# EAGLE design STM32BoardBeta2 (EAGLE 7.2.0)
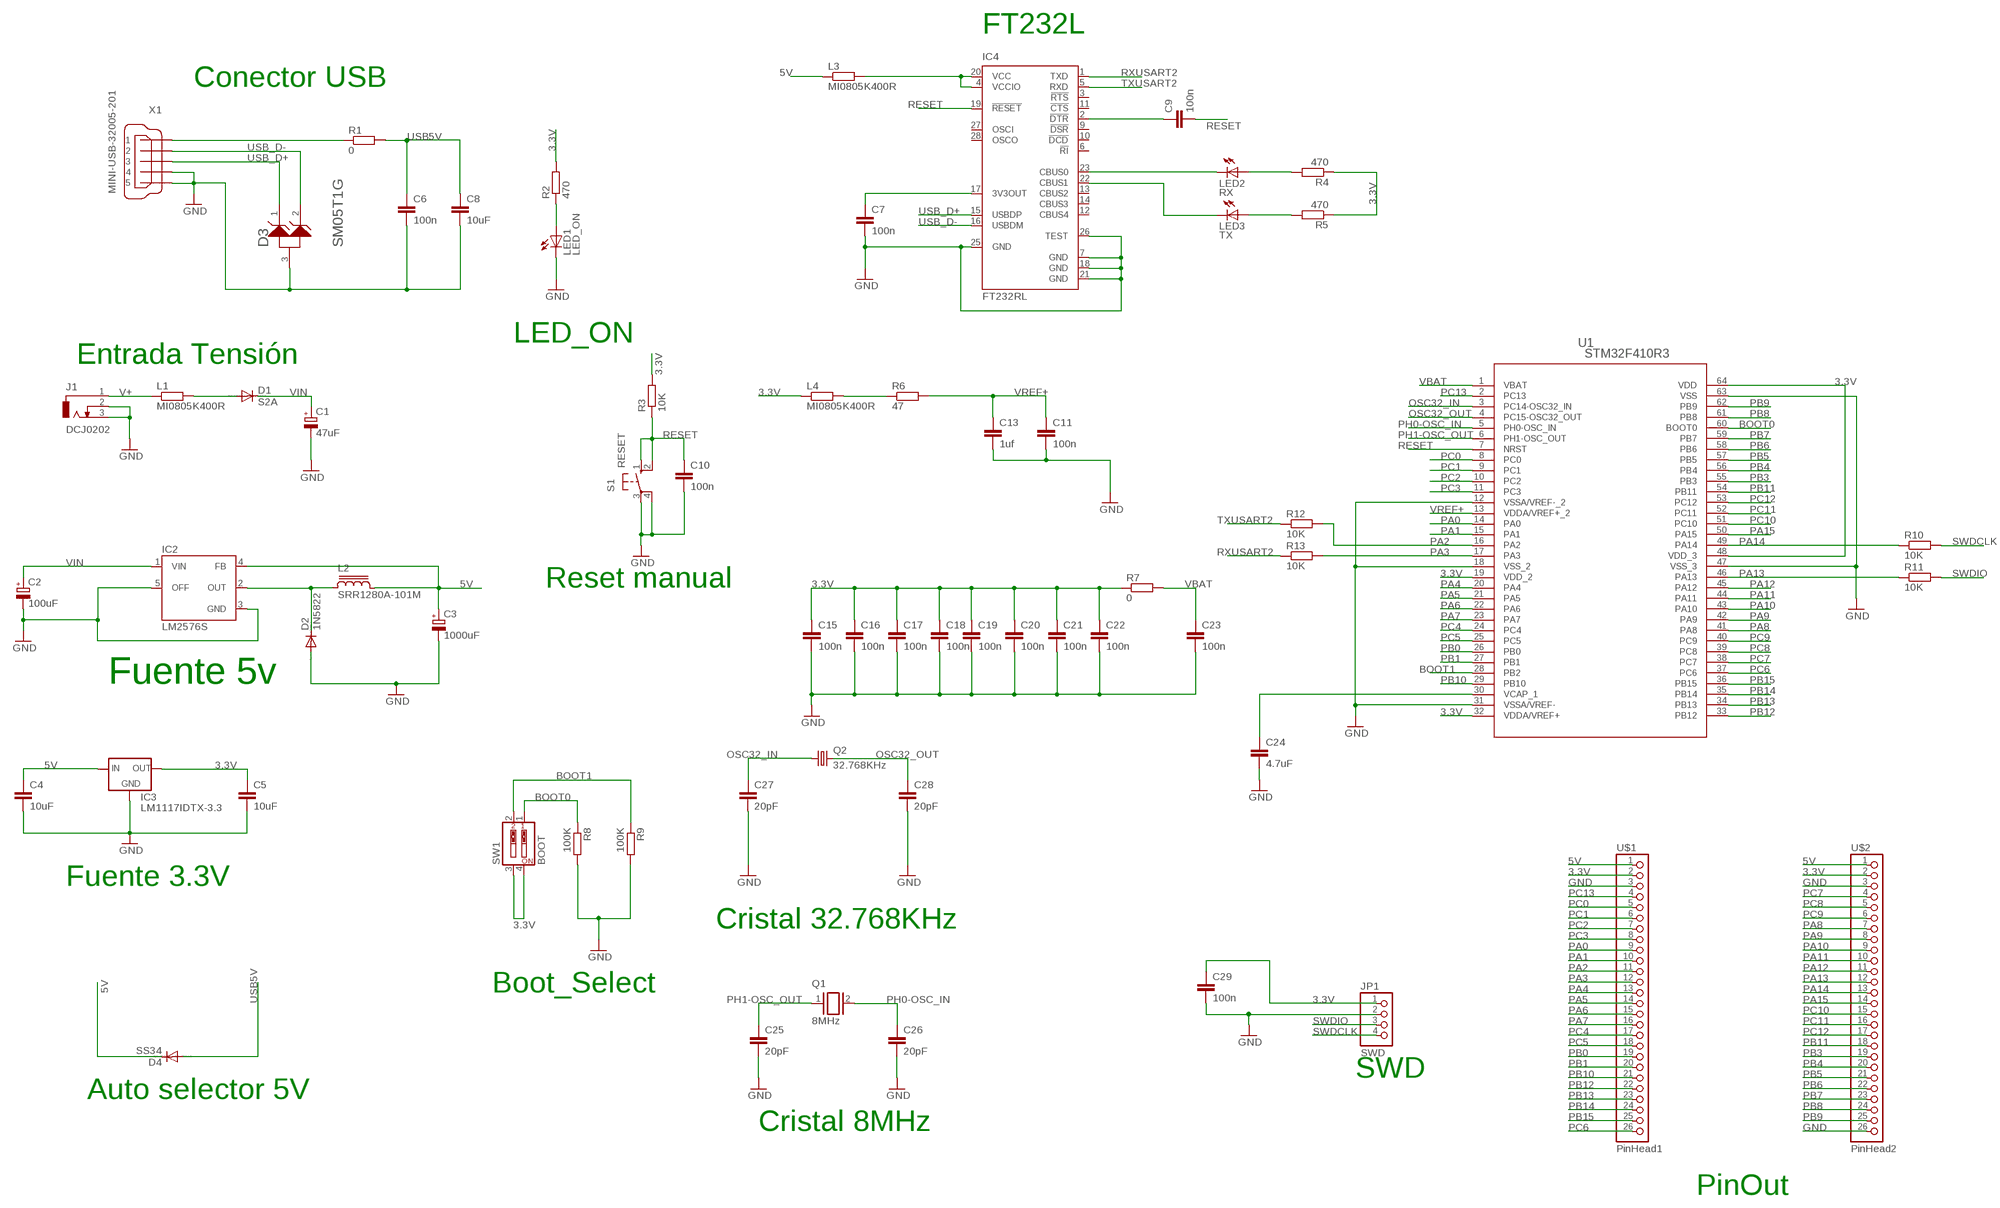
[diagram p0: schematic, sheet 1]

## Parts
C1  47uF  CPOL-EU153CLV-0605  [153CLV-0605]
C2  100uF  CPOL-EU153CLV-0605  [153CLV-0605]
C3  1000uF  CPOL-EUE7.5-18  [E7,5-18]
C4  10uF  C-EUC1206K  [C1206K]
C5  10uF  C-EUC1206K  [C1206K]
C6  100n  C-EUC0805K  [C0805K]
C7  100n  C-EUC0805K  [C0805K]
C8  10uF  C-EUC1206K  [C1206K]
C9  100n  C-EUC0805K  [C0805K]
C10  100n  C-EUC0805K  [C0805K]
C11  100n  C-EUC0201  [C0201]
C13  1uf  C-EUC0603  [C0603]
C15  100n  C-EUC0805K  [C0805K]
C16  100n  C-EUC0805K  [C0805K]
C17  100n  C-EUC0805K  [C0805K]
C18  100n  C-EUC0805K  [C0805K]
C19  100n  C-EUC0805K  [C0805K]
C20  100n  C-EUC0805K  [C0805K]
C21  100n  C-EUC0805K  [C0805K]
C22  100n  C-EUC0805K  [C0805K]
C23  100n  C-EUC0805K  [C0805K]
C24  4.7uF  C-EUC1206K  [C1206K]
C25  20pF  C-EUC0805K  [C0805K]
C26  20pF  C-EUC0805K  [C0805K]
C27  20pF  C-EUC0805K  [C0805K]
C28  20pF  C-EUC0805K  [C0805K]
C29  100n  C-EUC0201  [C0201]
D1  S2A  DIODE-DO214AA  [DO214AA]
D2  1N5822  1N4004  [DO41-10]
D3  ON_SEMICONDUCTOR_SM05T1GON_SEMICONDUCTOR_SM05T1G_0_0  [ON_SEMICONDUCTOR_SM05T1G_0]
D4  SS34  DIODE-DO-214AC  [DO-214AC]
IC2  LM2576S  [TO263-5]
IC3  LM1117IDTX-3.3  [TO252]
IC4  FT232RL  [SSOP28]
J1  DCJ0202  [DCJ0202]
JP1  SWD  PINHD-1X4_2.54  [1X04]
L1  MI0805K400R  R-EU_M0805  [M0805]
L2  SRR1280A-101M  SRR1280  [SRR1280]
L3  MI0805K400R  R-EU_M0805  [M0805]
L4  MI0805K400R  R-EU_M0805  [M0805]
LED1  LED_ON  LEDCHIP-LED0805  [CHIP-LED0805]
LED2  RX  LEDCHIP-LED0805  [CHIP-LED0805]
LED3  TX  LEDCHIP-LED0805  [CHIP-LED0805]
Q1  8MHz  XTAL/S  [QS]
Q2  32.768KHz  CRYSTALTC26V  [TC26V]
R1  0  R-EU_M1206  [M1206]
R2  470  R-EU_R0805  [R0805]
R3  10K  R-EU_R1206  [R1206]
R4  470  R-EU_R0805  [R0805]
R5  470  R-EU_R0805  [R0805]
R6  47  R-EU_R0402  [R0402]
R7  0  R-EU_M1206  [M1206]
R8  100K  R-EU_R0805  [R0805]
R9  100K  R-EU_R0805  [R0805]
R10  10K  R-EU_R0805  [R0805]
R11  10K  R-EU_R0805  [R0805]
R12  10K  R-EU_R0805  [R0805]
R13  10K  R-EU_R0805  [R0805]
S1  RESET  10-XX  [B3F-10XX]
SW1  BOOT  SW_DIP-2  [EDG-02]
U1  STM32F410R3  [LQFP64-10X10MM]
U$1  PinHead1  PINHD-1X26_2.54  [1X26]
U$2  PinHead2  PINHD-1X26_2.54  [1X26]
X1  MINI-USB-32005-201  [32005-201]

## Nets
3.3V: C5.1 C15.1 C16.1 C17.1 C18.1 C19.1 C20.1 C21.1 C22.1 C29.1 IC3.TAB(OUT) JP1.1 L4.1 R2.2 R3.2 R4.1 R5.1 R7.1 SW1.3 SW1.4 U1.19(VDD_2) U1.32(VDDA/VREF+) U1.48(VDD_3) U1.64(VDD) U$1.2 U$2.2
5V: C3.+ C4.1 D4.C IC2.4(FB) IC3.2(IN) L2.2 L3.1 U$1.1 U$2.1
BOOT0: R8.1 SW1.1 U1.60(BOOT0)
BOOT1: R9.1 SW1.2 U1.28(PB2)
GND: C1.- C2.- C3.- C4.2 C5.2 C6.2 C7.2 C8.2 C10.2 C11.2 C13.2 C15.2 C16.2 C17.2 C18.2 C19.2 C20.2 C21.2 C22.2 C23.2 C24.2 C25.2 C26.2 C27.2 C28.2 C29.2 D2.A D3.3(A) IC2.3(GND) IC2.5(OFF) IC3.1(GND) IC4.7(GND) IC4.18(GND) IC4.21(GND) IC4.25(GND) IC4.26(TEST) J1.2 J1.3 JP1.2 LED1.C R8.2 R9.2 S1.3(P) S1.4(P1) U1.12(VSSA/VREF-_2) U1.18(VSS_2) U1.31(VSSA/VREF-) U1.47(VSS_3) U1.63(VSS) U$1.3 U$2.3 U$2.26 X1.4 X1.5
N$1: LED1.A R2.1
N$2: IC4.4(VCCIO) IC4.20(VCC) L3.2
N$3: D1.A L1.2
N$4: D2.C IC2.2(OUT) L2.1
N$5: C7.1 IC4.17(3V3OUT)
N$6: R1.1 X1.1
N$7: IC4.23(CBUS0) LED2.C
N$8: C9.1 IC4.2(!DTR)
N$9: IC4.22(CBUS1) LED3.C
N$10: LED2.A R4.2
N$11: LED3.A R5.2
N$12: C24.1 U1.30(VCAP_1)
OSC32_IN: C27.1 Q2.1 U1.3(PC14-OSC32_IN)
OSC32_OUT: C28.1 Q2.2 U1.4(PC15-OSC32_OUT)
PA0: U1.14(PA0) U$1.9
PA1: U1.15(PA1) U$1.10
PA2: R12.2 U1.16(PA2) U$1.11
PA3: R13.2 U1.17(PA3) U$1.12
PA4: U1.20(PA4) U$1.13
PA5: U1.21(PA5) U$1.14
PA6: U1.22(PA6) U$1.15
PA7: U1.23(PA7) U$1.16
PA8: U1.41(PA8) U$2.7
PA9: U1.42(PA9) U$2.8
PA10: U1.43(PA10) U$2.9
PA11: U1.44(PA11) U$2.10
PA12: U1.45(PA12) U$2.11
PA13: R11.1 U1.46(PA13) U$2.12
PA14: R10.1 U1.49(PA14) U$2.13
PA15: U1.50(PA15) U$2.14
PB0: U1.26(PB0) U$1.19
PB1: U1.27(PB1) U$1.20
PB3: U1.55(PB3) U$2.19
PB4: U1.56(PB4) U$2.20
PB5: U1.57(PB5) U$2.21
PB6: U1.58(PB6) U$2.22
PB7: U1.59(PB7) U$2.23
PB8: U1.61(PB8) U$2.24
PB9: U1.62(PB9) U$2.25
PB10: U1.29(PB10) U$1.21
PB11: U1.54(PB11) U$2.18
PB12: U1.33(PB12) U$1.22
PB13: U1.34(PB13) U$1.23
PB14: U1.35(PB14) U$1.24
PB15: U1.36(PB15) U$1.25
PC0: U1.8(PC0) U$1.5
PC1: U1.9(PC1) U$1.6
PC2: U1.10(PC2) U$1.7
PC3: U1.11(PC3) U$1.8
PC4: U1.24(PC4) U$1.17
PC5: U1.25(PC5) U$1.18
PC6: U1.37(PC6) U$1.26
PC7: U1.38(PC7) U$2.4
PC8: U1.39(PC8) U$2.5
PC9: U1.40(PC9) U$2.6
PC10: U1.51(PC10) U$2.15
PC11: U1.52(PC11) U$2.16
PC12: U1.53(PC12) U$2.17
PC13: U1.2(PC13) U$1.4
PH0-OSC_IN: C26.1 Q1.2 U1.5(PH0-OSC_IN)
PH1-OSC_OUT: C25.1 Q1.1 U1.6(PH1-OSC_OUT)
RESET: C9.2 C10.1 IC4.19(!RESET) R3.1 S1.1(S) S1.2(S1) U1.7(NRST)
RXUSART2: IC4.1(TXD) R13.1
SWDCLK: JP1.4 R10.2
SWDIO: JP1.3 R11.2
TXUSART2: IC4.5(RXD) R12.1
USB5V: C6.1 C8.1 D4.A R1.2
USB_D+: D3.1(K1) IC4.15(USBDP) X1.3
USB_D-: D3.2(K2) IC4.16(USBDM) X1.2
V+: J1.1 L1.1
VBAT: C23.1 R7.2 U1.1(VBAT)
VIN: C1.+ C2.+ D1.C IC2.1(VIN)
VREF+: C11.1 C13.1 R6.2 U1.13(VDDA/VREF+_2)
VREF+2: L4.2 R6.1
Unconnected: IC4.3(!RTS) IC4.6(!RI) IC4.9(!DSR) IC4.10(!DCD) IC4.11(!CTS) IC4.12(CBUS4) IC4.13(CBUS2) IC4.14(CBUS3) IC4.27(OSCI) IC4.28(OSCO)

## Notes on the sheet
- FT232L
- Conector USB
- LED_ON
- Entrada Tensión
- Reset manual
- Fuente 5v
- Fuente 3.3V
- Cristal 32.768KHz
- Boot_Select
- SWD
- Auto selector 5V
- Cristal 8MHz
- PinOut

## Library data of the parts
C1-C3 = rcl:CPOL-EU: POLARIZED CAPACITOR, European symbol
C4-C11 C13 C15-C29 = rcl:C-EU: CAPACITOR, European symbol
D1 D4 = diode:DIODE-: DIODE
D2 = diode:1N4004: DIODE general purpose rectifier, 1 A
D3 = On Semiconductor - SM05T1G:ON_SEMICONDUCTOR_SM05T1G: ONSC-K1K2A3-3; COMPONENT_LINK_1_DESCRIPTION: Manufacturer URL; COMPONENT_LINK_1_URL: http://www.onsemi.com/; COMPONENT_LINK_3_DESCRIPTION: Package Specification; COMPONENT_LINK_3_URL: http://www.onsemi.cn/pub_link/Collateral/318-08.PDF; DATASHEET: http://www.onsemi.com/pub_link/Collateral/SM12T1-D.PDF; DATASHEET_VERSION: Rev. 6; DIRECTION: Unidirectional; IMPORTED: yes; IMPORTED_FROM: vault; IMPORT_TS: 1521207419; IR_MAX_UA: 10; MF: On Semiconductor; MOUNTING_TECHNOLOGY: Surface Mount; MPN: SM05T1G; PACKAGE: SOT-23-3-318-08; PACKAGE_DESCRIPTION: 3-Pin Small Outline Transistor, Body 2.92 x 1.3 mm, Pitch 0.95 mm; PACKAGE_VERSION: Rev. AP, 11/2009; PACKING: Tape and Reel; PPK_MAX_W: 300; PREFIX: D; ROHS: No; VAULT_GUID: 89044E51-EF64-408A-9843-719D3C75EAAE; VAULT_REVISION: BDB54648-0F6E-4B9B-8D45-1873251A89B8
IC2 = v-reg-3:LM2576: National Semiconductor <http://www.national.com> 3.0A "Simple Switcher"(c) 52kHz, Vout 1.23-37V (HV: 57V), Vin 40V (HV: 60V), 50µA standby current
IC3 = lm1117:LM1117IDTX-*
IC4 = ftdichip:FT232R: Source: http://www.ftdichip.com/Documents/DataSheets/DS_FT232R_v104.pdf; MPN: FT232RL; OC_FARNELL: 1146032; OC_NEWARK: 91K9918
J1 = con-jack:DCJ0202: DC POWER JACK Source: DCJ0202.pdf; OC_FARNELL: unknown; OC_NEWARK: unknown
JP1 = pinhead-1:PINHD-1X4: PIN HEADER
L1 L3 L4 = resistor:R-EU_: RESISTOR, European symbol
L2 = inductor-bourns:SRR1280: POWER INDUCTOR
LED1-LED3 = led:LED: LED OSRAM: - CHIPLED LG R971, LG N971, LY N971, LG Q971, LY Q971, LO R971, LY R971 LH N974, LH R974 LS Q976, LO Q976, LY Q976 LO Q996 - Hyper CHIPLED LW Q18S LB Q993, LB Q99A, LB R99A - SideLED LS A670, LO A670, LY A670, LG A670, LP A670 LB A673, LV A673, LT A673, LW A673 LH A674 LY A675 LS A676, LA A676, LO A676, LY A676, LW A676 LS A679, LY A679, LG A679 - Hyper Micro SIDELED® LS Y876, LA Y876, LO Y876, LY Y876 LT Y87S - SmartLED LW L88C, LW L88S LB L89C, LB L89S, LG L890 LS L89K, LO L89K, LY L89K LS L896, LA L896, LO L896, LY L896 - TOPLED LS T670, LO T670, LY T670, LG T670, LP T670 LSG T670, LSP T670, LSY T670, LOP T670, LYG T670 LG T671, LOG T671, LSG T671 LB T673, LV T673, LT T673, LW T673 LH T674 LS T676, LA T676, LO T676, LY T676, LB T676, LH T676, LSB T676, LW T676 LB T67C, LV T67C, LT T67C, LS T67K, LO T67K, LY T67K, LW E67C LS E67B, LA E67B, LO E67B, LY E67B, LB E67C, LV E67C, LT E67C LW T67C LS T679, LY T679, LG T679 LS T770, LO T770, LY T770, LG T770, LP T770 LB T773, LV T773, LT T773, LW T773 LH T774 LS E675, LA E675, LY E675, LS T675 LS T776, LA T776, LO T776, LY T776, LB T776 LHGB T686 LT T68C, LB T68C - Hyper Mini TOPLED® LB M676 - Mini TOPLED Santana® LG M470 LS M47K, LO M47K, LY M47K Source: http://www.osram.convergy.de LUXEON: - LUMILED® LXK2-PW12-R00, LXK2-PW12-S00, LXK2-PW14-U00, LXK2-PW14-V00 LXK2-PM12-R00, LXK2-PM12-S00, LXK2-PM14-U00 LXK2-PE12-Q00, LXK2-PE12-R00, LXK2-PE12-S00, LXK2-PE14-T00, LXK2-PE14-U00 LXK2-PB12-K00, LXK2-PB12-L00, LXK2-PB12-M00, LXK2-PB14-N00, LXK2-PB14-P00, LXK2-PB14-Q00 LXK2-PR12-L00, LXK2-PR12-M00, LXK2-PR14-Q00, LXK2-PR14-R00 LXK2-PD12-Q00, LXK2-PD12-R00, LXK2-PD12-S00 LXK2-PH12-R00, LXK2-PH12-S00 LXK2-PL12-P00, LXK2-PL12-Q00, LXK2-PL12-R00 Source: www.luxeon.com KINGBRIGHT: KA-3528ASYC Source: www.kingbright.com
Q1 = special:XTAL/S: CRYSTAL
Q2 = crystal:CRYSTAL: CRYSTAL; OC_FARNELL: unknown; OC_NEWARK: unknown
R1-R13 = rcl:R-EU_: RESISTOR, European symbol
S1 = switch-omron:10-XX: OMRON SWITCH; MPN: B3F-1000; OC_FARNELL: 176432; OC_NEWARK: 36M3542
SW1 = special:SW_DIP-2: DIP SWITCH
U1 = smr32f410rbt6:STM32F410R3; MANUFACTURER_PART_NUMBER: STM32F410R3; VENDOR: STMicroelectronics
U$1 U$2 = pinhead-1:PINHD-1X26: PIN HEADER
X1 = con-cypressindustries:MINI-USB-: MINI USB-B Conector Source: www.cypressindustries.com; OC_FARNELL: unknown; OC_NEWARK: unknown

## Board
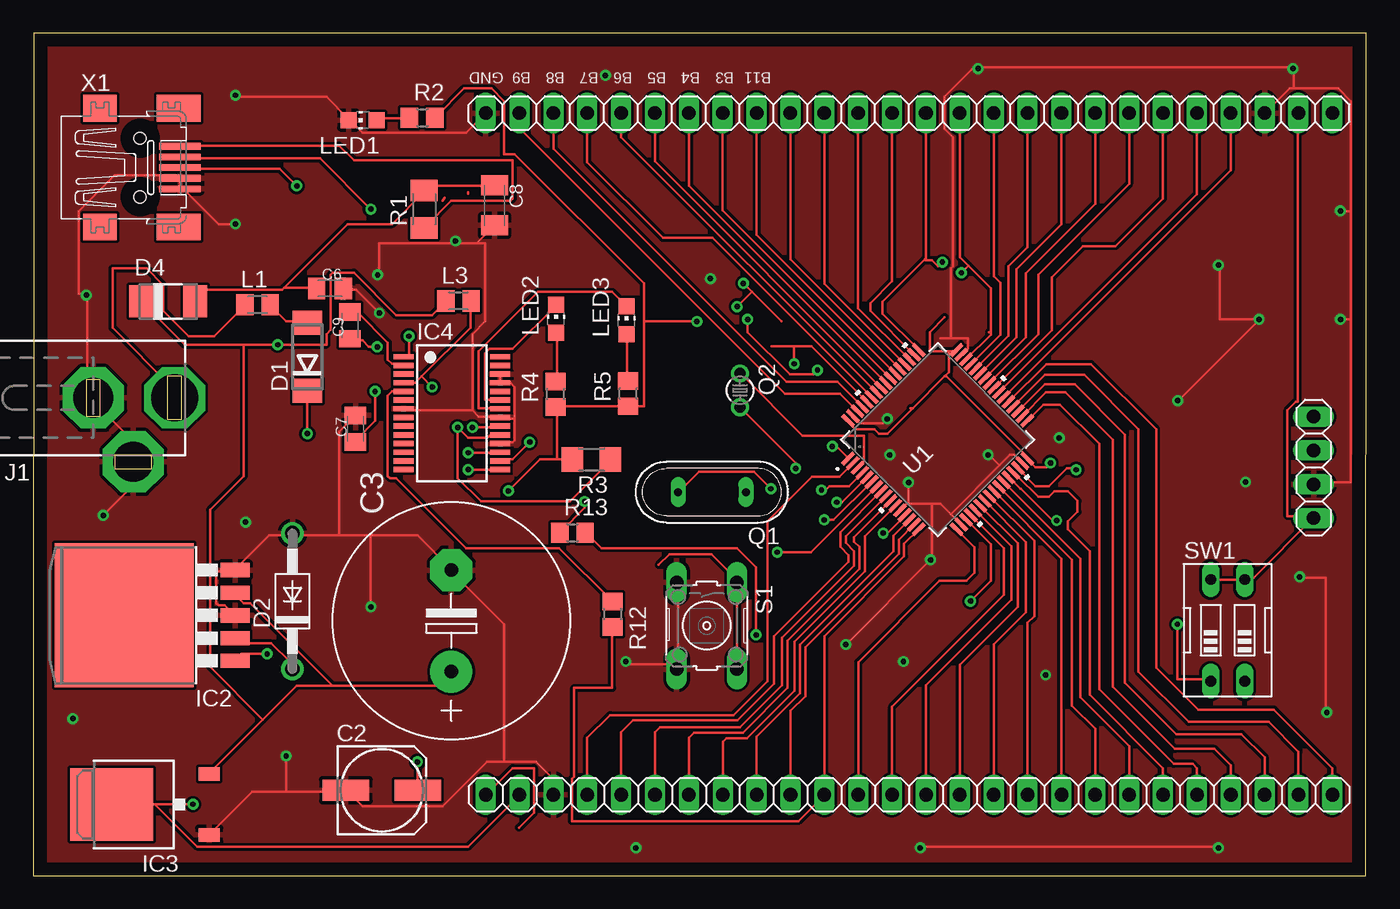
[diagram p1: board, top side]
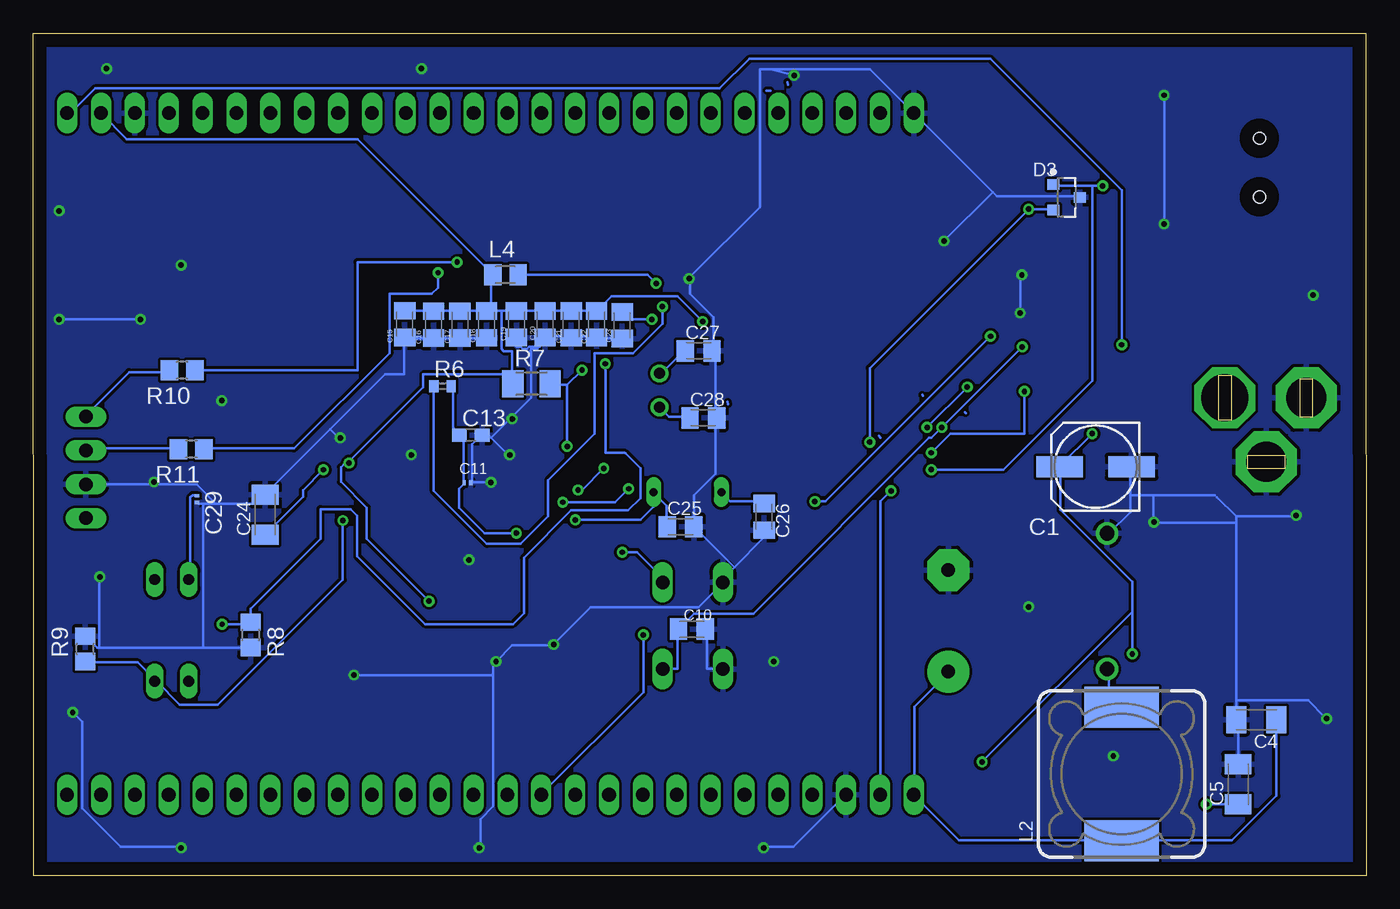
[diagram p2: board, bottom side, seen from below]

Size 99.95 x 63.14 mm. Coordinates in mm from the lower left corner, seen from the top.
Outline: 0,0 99.93,0 99.95,63.14 0.03,63.14 0,0
Copper layers (1*16): Top 0.035mm / dielectric 1.5mm / Bottom 0.035mm
Design rules "default *": minimum track width 8mil, minimum drill 16mil, track to track 8mil, track to pad 8mil, pad to pad 8mil, via to via 8mil, smd to smd 8mil, copper to edge 40mil, drill to drill 8mil, minimum pad ring 10mil, minimum via ring 8mil, stop-mask expansion 4mil, vias tented up to drill 0mil, thermal gap 10mil

### Footprints (pad centres in the part's own frame; a part is rotated, then mirrored left to right if it is on the bottom)
153CLV-0605 = smd 3.5 x 1.6: + 2.7,0; - -2.7,0
E7,5-18 = drill 1.016 pad 3.15: + -3.81,0 | drill 1.016 pad 3.15 octagon: - 3.81,0
C1206K = smd 1.5 x 2: 1 -1.5,0; 2 1.5,0
C0805K = smd 1.3 x 1.6: 1 -1,0; 2 1,0
C0201 = smd 0.25 x 0.35: 1 -0.25,0; 2 0.25,0
C0603 = smd 1.1 x 1: 1 -0.85,0; 2 0.85,0
DO214AA = smd 1.8 x 2.2: A 2.55,0; C -2.55,0
DO41-10 = drill 1.118: A 5.08,0; C -5.08,0
ON_SEMICONDUCTOR_SM05T1G_0 = smd 0.9 x 0.8: 1 -1,0.95; 2 -1,-0.95; 3 1,0
DO-214AC = smd 1.8 x 2.4: A 2.025,0; C -2.025,0
TO263-5 = smd 1.067 x 2.159: 1 -3.404,-5.791; 2 -1.702,-5.791; 3 0,-5.791; 4 1.702,-5.791; 5 3.404,-5.791 | smd 10.8 x 10.41: 6 0,2.54
TO252 = smd 1 x 1.6: 1 -2.28,-4.8; 2 2.28,-4.8 | smd 5.4 x 6.2: TAB 0,2.5
SSOP28 = smd 0.4 x 1.5: 1 -4.225,-3.625; 2 -3.575,-3.625; 3 -2.925,-3.625; 4 -2.275,-3.625; 5 -1.625,-3.625; 6 -0.975,-3.625; 7 -0.325,-3.625; 8 0.325,-3.625; 9 0.975,-3.625; 10 1.625,-3.625; 11 2.275,-3.625; 12 2.925,-3.625; 13 3.575,-3.625; 14 4.225,-3.625; 15 4.225,3.625; 16 3.575,3.625; 17 2.925,3.625; 18 2.275,3.625; 19 1.625,3.625; 20 0.975,3.625; 21 0.325,3.625; 22 -0.325,3.625; 23 -0.975,3.625; 24 -1.625,3.625; 25 -2.275,3.625; 26 -2.925,3.625; 27 -3.575,3.625; 28 -4.225,3.625
DCJ0202 = drill 3.531 pad 4.572 octagon: 1 0,3.1 | drill 2.997 pad 4.572 octagon: 2 4.8,0; 3 0,-3
1X04 = drill 1.016 long: 1 -3.81,0; 2 -1.27,0; 3 1.27,0; 4 3.81,0
M0805 = smd 1.3 x 1.6: 1 -0.95,0; 2 0.95,0
SRR1280 = smd 5.6 x 3.1: 1 0.635,5; 2 0.635,-5
CHIP-LED0805 = smd 1.2 x 1.2: A 0,-1.05; C 0,1.05
QS = drill 0.61 long: 1 -2.54,0; 2 2.54,0
TC26V = drill 0.813: 1 -1.27,0; 2 1.27,0
M1206 = smd 1.6 x 2: 1 -1.4,0; 2 1.4,0
R0805 = smd 1.3 x 1.5: 1 -0.95,0; 2 0.95,0
R1206 = smd 1.6 x 1.803: 1 -1.422,0; 2 1.422,0
R0402 = smd 0.7 x 0.9: 1 -0.65,0; 2 0.65,0
B3F-10XX = drill 1.016 long: 1 -3.251,2.261; 2 3.251,2.261; 3 -3.251,-2.261; 4 3.251,-2.261
EDG-02 = drill 0.813 long: 1 -1.27,-3.81; 2 1.27,-3.81; 3 1.27,3.81; 4 -1.27,3.81
LQFP64-10X10MM = smd 1.194 x 0.305: 1 -5.75,3.75; 2 -5.75,3.25; 3 -5.75,2.75; 4 -5.75,2.25; 5 -5.75,1.75; 6 -5.75,1.25; 7 -5.75,0.75; 8 -5.75,0.25; 9 -5.75,-0.25; 10 -5.75,-0.75; 11 -5.75,-1.25; 12 -5.75,-1.75; 13 -5.75,-2.25; 14 -5.75,-2.75; 15 -5.75,-3.25; 16 -5.75,-3.75; 33 5.75,-3.75; 34 5.75,-3.25; 35 5.75,-2.75; 36 5.75,-2.25; 37 5.75,-1.75; 38 5.75,-1.25; 39 5.75,-0.75; 40 5.75,-0.25; 41 5.75,0.25; 42 5.75,0.75; 43 5.75,1.25; 44 5.75,1.75; 45 5.75,2.25; 46 5.75,2.75; 47 5.75,3.25; 48 5.75,3.75 | smd 0.305 x 1.194: 17 -3.75,-5.75; 18 -3.25,-5.75; 19 -2.75,-5.75; 20 -2.25,-5.75; 21 -1.75,-5.75; 22 -1.25,-5.75; 23 -0.75,-5.75; 24 -0.25,-5.75; 25 0.25,-5.75; 26 0.75,-5.75; 27 1.25,-5.75; 28 1.75,-5.75; 29 2.25,-5.75; 30 2.75,-5.75; 31 3.25,-5.75; 32 3.75,-5.75; 49 3.75,5.75; 50 3.25,5.75; 51 2.75,5.75; 52 2.25,5.75; 53 1.75,5.75; 54 1.25,5.75; 55 0.75,5.75; 56 0.25,5.75; 57 -0.25,5.75; 58 -0.75,5.75; 59 -1.25,5.75; 60 -1.75,5.75; 61 -2.25,5.75; 62 -2.75,5.75; 63 -3.25,5.75; 64 -3.75,5.75
1X26 = drill 1.016 long: 1 -29.21,0; 2 -26.67,0; 3 -24.13,0; 4 -21.59,0; 5 -19.05,0; 6 -16.51,0; 7 -13.97,0; 8 -11.43,0; 9 -8.89,0; 10 -6.35,0; 11 -3.81,0; 12 -1.27,0; 13 1.27,0; 14 3.81,0; 15 6.35,0; 16 8.89,0; 17 11.43,0; 18 13.97,0; 19 16.51,0; 20 19.05,0; 21 21.59,0; 22 24.13,0; 23 26.67,0; 24 29.21,0; 25 31.75,0; 26 34.29,0
32005-201 = smd 3.1 x 0.5: 1 3,1.6; 2 3,0.8; 3 3,0; 4 3,-0.8; 5 3,-1.6 | smd 2.5 x 2: M1 -3,-4.45; M2 -3,4.45 | smd 3.3 x 2: M3 2.9,4.45; M4 2.9,-4.45 | hole 0.9: 0,2.2; 0,-2.2

### Placement (x,y rotation side)
C1  20.29,30.66 180 bottom
C2  26.14,6.4 0 top
C3  31.34,19.1 90 top
C4  8.23,11.68 180 bottom
C5  9.6,6.86 90 bottom
C6  22.25,44.02 0 top
C7  24.16,33.5 90 top
C8  34.59,50.24 270 top
C9  23.75,41.25 270 top
C10  50.57,18.48 0 bottom
C11  67.4,29.45 0 bottom
C13  67.16,33.02 0 bottom
C15  72.1,41.35 270 bottom
C16  69.94,41.31 270 bottom
C17  67.96,41.31 270 bottom
C18  65.96,41.32 270 bottom
C19  63.72,41.34 270 bottom
C20  61.57,41.34 270 bottom
C21  59.62,41.32 270 bottom
C22  57.71,41.34 270 bottom
C23  55.79,41.26 270 bottom
C24  82.58,27.07 90 bottom
C25  51.42,26.16 0 bottom
C26  45.15,26.9 270 bottom
C27  50.06,39.34 0 bottom
C28  49.71,34.32 0 bottom
C29  87.69,28.23 270 bottom
D1  20.55,38.91 90 top
D2  19.43,20.57 90 top
D3  22.45,50.85 0 bottom
D4  10.11,43.05 0 top
IC2  9.35,19.51 90 top
IC3  8.38,5.33 90 top
IC4  31.39,34.67 270 top
J1  7.49,35.81 270 top
JP1  96.01,30.61 90 top
L1  16.81,42.8 0 top
L2  18.97,7.62 0 bottom
L3  31.88,43.08 0 top
L4  64.56,45.05 0 bottom
LED1  24.69,56.64 90 top
LED2  39.19,41.76 0 top
LED3  44.48,41.63 0 top
Q1  50.9,28.75 180 top
Q2  52.99,36.38 270 top
R1  29.31,49.96 90 top
R2  29.16,56.82 0 top
R3  41.84,31.2 180 top
R4  39.17,36.09 90 top
R5  44.6,36.14 90 top
R6  69.27,36.7 0 bottom
R7  62.6,36.88 0 bottom
R8  83.67,18.05 270 bottom
R9  96.05,16.99 90 bottom
R10  88.8,37.87 180 bottom
R11  88.11,31.98 180 bottom
R12  43.43,19.6 270 top
R13  40.42,25.71 0 top
S1  50.51,18.74 270 top
SW1  89.57,18.39 0 top
U1  67.82,32.69 45 top
U$1  63.13,6.06 0 top
U$2  68.21,57.17 180 top
X1  8,53.09 0 top

### Tracks (layer width: path | path; a pad name or v marks a point on that pad's centre or on a via)
3.3V  (via drill 0.41)
  Top 0.203: 68.33,37.42 68.65,37.74 68.65,39.33 | 68.33,37.42 65.95,35.04 | 65.95,35.04 64.05,33.13 63.41,33.13 63.09,33.45 61.66,33.45 61.03,34.09 U1.64 | 68.65,39.33 69.13,39.33 U1.48 | 68.33,37.42 68.49,37.42 74.52,31.39 U1.32 74.54,31.25 75.16,30.63 75.97,30.63 v76.28,30.94 | 65.95,35.04 65.79,35.04 | 68.33,41.87 67.22,40.75 67.22,39.33 68.65,39.33 | SW1.4 88.33,22.18 90.72,22.18 SW1.3 90.87,22.34 91.51,22.34 95.95,26.78 JP1.1 95.95,26.94 94.05,26.94 94.05,34.88 94.68,35.52 94.84,35.52 94.84,57.11 U$2.2 | U$1.2 36.42,5.99 32.61,2.18 12.29,2.18 9.12,5.35 | U1.19 69.97,26.68 71.81,24.84 71.81,22.1 v70.28,20.57 | 9.12,5.35 5.94,5.35 IC3.TAB | 9.12,5.35 v11.98,5.35 | R2.2 30.23,56.95 32.3,59.01 34.36,59.01 35.31,58.06 35.31,54.09 36.11,54.09 45.79,44.41 45.79,41.55 | 39.28,31.23 39.28,35.04 R4.1 39.28,35.2 44.52,35.2 R5.1 44.68,35.2 45.79,35.2 45.79,41.55 | 39.28,31.23 40.39,31.23 R3.2 | v35.63,28.85 38.01,31.23 39.28,31.23 | 45.79,41.55 v49.76,41.55
  Bottom 0.203: C29.1 87.7,28.53 88.02,28.53 88.18,28.37 88.18,22.34 SW1.4 | U$2.2 94.84,57.11 92.94,55.2 75.63,55.2 65.63,45.2 L4.1 65.63,45.04 65.63,42.34 | 36.58,6.15 U$1.2 36.42,6.15 36.42,28.05 v35.63,28.85 | v70.28,20.57 74.96,25.25 74.96,27.58 76.89,29.51 76.89,30.63 76.58,30.94 v76.28,30.94 76.27,31.07 70.71,36.63 70.71,37.58 64.05,37.58 | v11.98,5.35 9.75,5.35 C5.1 | C15.1 71.98,42.34 70.08,42.34 C16.1 69.92,42.34 68.01,42.34 C17.1 67.86,42.34 66.11,42.34 C18.1 | 65.63,42.34 65.95,42.34 C18.1 | 64.05,37.58 64.05,39.33 64.68,39.33 64.84,39.48 64.84,42.34 | 64.05,37.58 64.05,36.94 R7.1 64.05,37.58 | 65.63,42.34 64.84,42.34 | 65.63,42.34 C18.1 | 64.84,42.34 C19.1 63.57,42.34 61.66,42.34 C20.1 61.51,42.34 59.76,42.34 C21.1 59.6,42.34 57.85,42.34 C22.1 57.7,42.34 56.58,43.45 51.66,43.45 v49.76,41.55
5V  (via drill 0.41)
  Top 0.203: 33.88,6.15 U$1.1 34.04,6.15 35.95,8.05 37.53,8.05 37.53,4.72 36.42,3.61 | 17.21,11.7 19.75,14.24 22.45,14.24 | 17.21,11.7 13.25,7.73 IC3.2 | 22.45,14.24 30.39,14.24 31.34,15.2 C3.+ | 22.45,14.24 16.26,20.43 15.79,20.43 15.15,21.07 IC2.4 | 15.79,39.8 11.34,39.8 8.17,42.98 D4.C | 15.79,39.8 v18.33,39.8 21.98,39.8 21.98,40.6 22.29,40.91 22.29,45.04 22.45,45.2 24.04,45.2 27.22,42.02 29.91,42.02 30.87,42.98 L3.1 | 17.21,11.7 13.25,15.67 13.25,27.42 15.79,29.96 15.79,39.8
  Bottom 0.203: U$2.1 97.38,57.26 97.07,57.26 95.32,59.01 48.49,59.01 46.27,61.23 28.17,61.23 18.33,51.39 v18.33,39.8 | C4.1 6.74,11.54 6.74,5.99 10.07,2.65 18.33,2.65 L2.2 18.48,2.65 30.55,2.65 33.88,5.99 U$1.1 33.88,6.15 33.88,12.66 31.34,15.2 C3.+
BOOT0  (via drill 0.41)
  Top 0.203: v85.79,18.85 85.79,14.72 88.18,14.72 SW1.1 | 55.35,39.67 57.06,39.67 | 57.06,39.67 58.36,39.67 U1.60 | v57.06,38.37 57.06,39.67
  Bottom 0.203: v85.79,18.85 83.73,18.85 R8.1 83.67,19.99 78.41,25.25 78.41,27.48 76.17,27.48 75.67,26.97 75.67,23.93 70.59,18.85 63.98,18.85 63.17,19.66 63.17,23.82 59.61,27.38 55.35,27.38 54.43,28.3 54.43,30.53 55.55,31.65 55.63,31.71 57.06,31.71 v57.06,38.37
BOOT1  (via drill 0.41)
  Top 0.203: U1.28 73.19,29.86 74.04,29.01 74.05,29.01 76.43,26.63 v76.75,26.63
  Bottom 0.203: v76.75,26.63 76.75,22.18 86.11,12.81 88.97,12.81 90.72,14.56 SW1.2 90.87,14.72 92.14,15.99 95.95,15.99 R9.1
GND  (via drill 0.41)
  Top 0.203: 68.81,27.1 68.01,27.9 67.38,27.9 | 68.81,27.1 69.44,26.47 U1.18 | 65.63,27.9 65.47,27.9 65,27.42 U1.12 | 65.63,27.9 67.38,27.9 | 68.81,27.1 72.46,30.75 | 72.46,30.75 73.25,31.55 73.57,31.55 74.05,31.07 U1.31 | U1.63 61.51,34.4 61.98,33.93 63.73,33.93 v64.05,34.25 | 68.01,40.28 68.81,40.28 | 68.81,40.28 70.08,40.28 70.08,39.48 69.6,39.01 U1.47 | v65.63,29.48 65.63,27.9 | 94.53,59.01 97.86,59.01 98.81,58.06 98.81,49.8 | 94.53,59.01 94.21,59.01 92.46,57.26 U$2.3 | 98.81,41.71 98.81,29.48 96.11,29.48 JP1.2 | 98.81,41.71 98.81,49.8 | 48.17,22.34 S1.3 48.33,22.18 48.33,15.83 S1.4 48.17,15.83 44.68,15.83 44.52,15.99 v44.42,16.05 | 11.02,51.71 11.02,52.18 X1.4 10.86,52.34 10.71,52.5 6.1,52.5 3.4,49.8 3.4,43.61 3.88,43.61 v3.98,43.52 4.04,43.61 4.04,35.99 J1.3 4.67,35.36 7.21,32.82 7.21,31.55 J1.2 7.21,30.91 7.21,29.01 5.31,27.1 v5.24,27.01 | 11.02,51.71 11.02,51.55 X1.5 11.02,51.71 | IC2.3 14.99,19.64 14.36,20.28 13.88,20.28 13.72,20.43 13.72,22.82 14.99,22.82 IC2.5 15.15,22.97 17.69,25.51 19.28,25.51 D2.A 19.44,25.51 22.93,25.51 | 22.93,25.51 25.31,25.51 | 25.31,25.51 28.8,25.51 31.34,22.97 C3.- 31.34,22.82 35.31,18.85 35.31,8.53 | IC4.26 34.99,37.58 34.99,37.1 IC4.25 35.15,36.94 35.79,36.94 36.11,36.63 36.11,34.25 | 36.11,34.25 36.11,32.66 35.95,32.5 35.15,32.5 IC4.18 | 36.11,34.25 35.15,34.25 IC4.21 34.99,34.4 33.41,34.4 32.93,34.88 | 32.93,34.88 27.85,34.88 IC4.7 | 33.25,47.42 31.66,47.42 | 31.66,47.42 25.95,47.42 25.95,45.04 v25.82,45.04 | 33.25,47.42 34.52,48.69 C8.2 | 32.93,34.88 32.93,40.6 33.88,41.55 33.88,47.42 33.25,47.42 | U$2.26 33.88,57.11 32.45,55.68 24.68,55.68 23.72,56.63 LED1.C 23.56,56.79 21.98,58.38 15.15,58.38 v15.15,58.5
  Top 0.203: v31.66,47.58 31.66,47.42 | 18.96,6.31 23.41,6.31 C2.- 23.56,6.31 24.68,5.19 30.71,5.19 34.04,8.53 35.31,8.53 | 18.96,6.31 16.42,6.31 13.25,3.13 IC3.1 | v85.83,35.61 85.95,35.67 91.99,41.71 v91.92,41.71 88.97,41.71 88.97,45.68 v88.87,45.77 | 67.38,27.9 67.38,23.77 v67.28,23.67 v60.93,17.32 | 72.46,30.75 71.67,31.55 v71.6,31.55 | 98.81,41.71 v98.02,41.71 | 98.81,49.8 98.02,49.8 v98.02,49.83 | v97,12.24 96.91,12.34 96.91,22.34 95,22.34 v94.97,22.4 | 35.31,8.53 37.69,8.53 38.96,7.26 38.96,6.15 U$1.3 | 94.53,59.01 94.53,60.44 v94.46,60.5 94.37,60.6 70.87,60.6 v70.84,60.5 70.71,60.44 70.4,60.44 68.33,58.38 68.33,55.99 68.97,55.36 68.97,45.68 68.81,45.52 68.81,40.28 | 25.31,25.51 v25.31,20.15 | v15.15,48.85 13.88,48.85 11.02,51.71 | 22.93,25.51 22.93,33.29 24.04,34.4 C7.2 | v25.95,42.18 24.2,43.93 23.41,43.93 C6.2 | 18.96,6.31 v18.96,8.97 | v88.87,2.08 88.81,2.18 66.59,2.18 v66.52,2.08
  Bottom 0.203: 39.12,6.62 39.12,6.15 U$1.3 39.12,5.99 42.93,2.18 45.15,2.18 v45.19,2.08 | C27.2 48.96,39.33 48.81,39.17 48.81,34.4 C28.2 48.81,34.25 48.81,30.12 50.39,28.53 50.39,26.31 C25.2 50.39,26.15 47.38,23.13 | 47.38,23.13 48.17,22.34 S1.3 48.33,21.86 50.08,20.12 58.17,20.12 60.87,17.42 v60.93,17.32 61.03,17.26 64.05,17.26 v65.25,16.05 65.47,15.83 65.47,15.04 | 47.38,23.13 45.15,25.36 45.15,25.83 C26.2 | 67.06,29.48 67.06,32.34 66.43,32.98 C13.2 | 66.27,33.13 C13.2 | 67.06,29.48 v65.63,29.48 | 67.06,29.48 C11.2 | 95,17.1 95.16,17.1 95.95,17.89 R9.2 | 95,17.1 87.22,17.1 | 87.22,17.1 83.73,17.1 R8.2 | 86.27,27.9 83.25,27.9 82.62,28.53 C24.2 82.46,28.69 77.7,33.45 | 86.27,27.9 87.22,27.9 | 87.22,27.9 87.54,27.9 C29.2 | 90.87,29.32 87.7,29.32 86.27,27.9 | 90.87,29.32 95.95,29.32 JP1.2 | 87.22,27.9 87.22,17.1 | 77.7,33.45 73.57,37.58 72.14,37.58 72.14,40.28 C15.2 71.98,40.28 70.08,40.28 C16.2 69.92,40.28 68.01,40.28 C17.2 67.86,40.28 66.11,40.28 C18.2 | 49.12,39.48 C27.2 | C5.2 9.59,8.37 9.59,11.54 C4.2 9.75,11.7 9.75,13.13 | 9.75,26.94 9.75,26.47 | 9.75,26.47 9.75,13.13 | 11.18,28.37 9.75,26.94 | 17.69,28.53 17.69,27.26 19.28,25.67 D2.A | 17.69,28.53 17.69,30.59 C1.- | 17.69,28.53 15.94,28.53 | 15.94,28.53 11.34,28.53 | 44.68,60.44 37.22,60.44 34.04,57.26 U$2.26 33.88,57.11 28.01,51.23 | 44.68,60.44 45.47,60.44 45.47,50.12 50.71,44.88 v50.77,44.75 50.71,44.72 50.71,43.61 48.96,41.87 48.96,39.48 C27.2 | 44.68,60.44 v42.9,59.99 | 28.01,51.23 27.69,50.91 21.5,50.91 D3.3 | 28.01,51.23 v31.66,47.58 | 65.47,15.04 65.47,5.19 66.43,4.24 66.43,2.18 v66.52,2.08 | 65.47,15.04 v75.92,15.04 | v88.87,2.08 88.97,2.18 93.41,2.18 96.27,5.04 96.27,11.54 96.91,12.18 v97,12.24
  Bottom 0.203: 64.2,31.55 v64.24,31.55 64.36,31.55 65.63,32.82 | 77.7,33.45 77.06,32.82 v76.94,32.82 | 90.87,29.32 90.87,29.48 v90.91,29.51 | 95,17.1 95,22.34 v94.97,22.4 | v98.02,41.71 v91.92,41.71 | C23.2 55.79,40.28 57.7,40.28 C22.2 57.85,40.44 59.6,40.44 C21.2 59.76,40.44 61.51,40.44 C20.2 61.66,40.28 61.66,39.8 61.82,39.8 61.98,39.64 62.14,39.64 | 9.75,13.13 4.36,13.13 3.09,11.86 v2.96,11.77 | 15.94,28.53 15.94,26.63 v15.91,26.5 16.1,26.47 9.75,26.47 | 9.75,26.94 5.31,26.94 v5.24,27.01 | v15.15,48.85 v15.15,58.5 | 62.14,39.64 62.78,39.64 62.93,39.48 63.25,39.48 63.41,39.64 63.73,39.64 63.73,40.28 C19.2 | 62.14,39.64 62.14,39.48 62.62,39.48 62.65,39.33 | 62.65,39.33 62.65,39.32 | v25.95,42.18 25.95,45.04 v25.82,45.04 | 65.63,32.82 65.79,32.98 66.27,32.98 C13.2 | 64.05,34.4 62.62,35.83 62.62,39.33 62.65,39.33 | 64.05,34.4 65.63,32.82 | 64.05,34.4 v64.05,34.25 | C10.2 49.44,18.37 49.44,15.51 48.33,15.51 S1.4
  pour Top: 99.29,63.3 99.29,-0.2 0.23,-0.2 0.23,63.3
  pour Bottom: 99.29,63.3 99.29,-0.2 0.23,-0.2 0.23,63.3
N$1
  Top 0.203: LED1.A 25.79,56.79 28.17,56.79 R2.1
N$2  (via drill 0.41)
  Top 0.203: 29.12,37.42 32.77,41.07 32.77,42.98 L3.2 | 29.12,37.42 28.64,36.94 27.85,36.94 IC4.4 | v32.93,33.61 34.99,33.61 IC4.20 | 29.12,37.42 v29.91,36.63
  Bottom 0.203: v29.91,36.63 v32.93,33.61
N$3
  Top 0.203: L1.2 17.85,42.66 18.96,41.55 20.55,41.55 D1.A
N$4
  Top 0.203: IC2.2 15.15,17.74 15.47,17.42 17.85,17.42 19.28,15.99 19.28,15.51 D2.C
  Bottom 0.203: D2.C 19.28,15.35 19.28,13.45 18.48,12.66 L2.1
N$5  (via drill 0.41)
  Top 0.203: v32.61,31.71 34.99,31.71 IC4.17 | v25.63,36.31 25.63,34.09 24.2,32.66 C7.1
  Bottom 0.203: v32.61,31.71 31.18,33.13 25.63,33.13 v25.63,36.31
N$6
  Top 0.203: R1.1 29.44,48.69 31.34,50.6 35.79,50.6 35.95,50.76 35.95,53.61 24.04,53.61 22.93,54.72 11.02,54.72 X1.1
N$7
  Top 0.203: LED2.C 39.12,42.66 35.95,39.48 34.2,39.48 33.88,39.17 33.88,35.67 34.99,35.67 IC4.23
N$8
  Top 0.203: IC4.2 27.69,38.37 26.9,38.37 26.58,38.69 26.58,39.96 24.36,42.18 23.88,42.18 C9.1
N$9
  Top 0.203: LED3.C 44.36,42.82 43.41,43.77 37.85,43.77 33.41,39.33 33.41,35.04 34.99,35.04 IC4.22
N$10
  Top 0.203: LED2.A 39.28,40.6 39.28,37.1 R4.2
N$11
  Top 0.203: LED3.A 44.52,40.44 44.52,37.1 R5.2
N$12  (via drill 0.41)
  Top 0.203: U1.30 73.83,30.54 75.16,29.21 76.17,29.21 77.5,30.53 78.1,30.53 v78.21,30.43
  Bottom 0.203: v78.21,30.43 79.73,28.9 79.73,28.41 C24.1
N$13
  Bottom 0.203: 36.42,32.82 36.53,32.96 | 47.85,35.36 47.89,35.52 | 44.68,58.85 44.96,58.85 | 43.41,59.49 43.36,59.31 | 33.25,35.99 33.29,36.03 | 30.07,34.72 30.03,34.68
N$14
  Top 0.203: 32.61,51.23 32.61,51.1 | 30.71,50.6 30.84,50.81
OSC32_IN
  Top 0.203: U1.3 61.82,30.59 62.3,31.07 62.3,32.98 57.7,32.98 53.09,37.58 Q2.1
  Bottom 0.203: C27.1 51.19,39.33 52.93,37.58 Q2.1
OSC32_OUT  (via drill 0.41)
  Top 0.203: U1.4 61.16,29.21 59.72,29.21 59.41,28.9 v59.11,28.9 | v57.18,30.53 57.18,30.93 Q2.2
  Bottom 0.203: C28.1 50.87,34.4 52.3,34.4 52.93,35.04 Q2.2 | v59.11,28.9 58.8,28.9 v57.18,30.53
PA0
  Top 0.203: U$1.9 54.24,10.43 57.48,13.66 57.48,17.32 64.49,24.33 64.49,25.47 U1.14
PA1
  Top 0.203: U$1.10 56.78,12.36 57.89,13.46 57.89,17.12 64.9,24.13 64.9,25.17 U1.15
PA2
  Top 0.203: U1.16 65.3,24.87 65.3,23.93 59.32,17.94 U$1.11 59.28,5.99 57.38,4.08 40.39,4.08 40.39,7.26 40.55,7.42 40.55,14.08 43.41,14.08 43.41,18.53 R12.2
PA3  (via drill 0.41)
  Top 0.203: U$1.12 61.86,16.01 67.94,22.1 69.98,22.1 70.59,22.71 70.59,24.62 U1.17 69.25,25.97 | v54.2,18.05 54.2,23.13 52.77,24.56 42.61,24.56 41.5,25.67 R13.2
  Bottom 0.203: v54.2,18.05 54.2,13.77 61.82,6.15 U$1.12
PA4
  Top 0.203: U$1.13 64.4,12.66 72.79,21.05 72.79,24.54 U1.20
PA5
  Top 0.203: U$1.14 66.94,14.29 73.33,20.68 73.33,24.71 U1.21
PA6
  Top 0.203: U$1.15 69.48,15.81 73.84,20.17 73.84,24.91 U1.22
PA7
  Top 0.203: U$1.16 72.02,17.34 74.45,19.76 74.45,25 U1.23
PA8
  Top 0.203: U$2.7 82.18,51.88 75.36,45.06 75.36,40.58 U1.41
PA9
  Top 0.203: U$2.8 79.64,50.35 74.45,45.16 74.45,40.38 U1.42
PA10
  Top 0.203: U$2.9 77.1,48.83 73.74,45.47 73.74,40.37 U1.43
PA11
  Top 0.203: U$2.10 74.56,47.1 73.13,45.67 73.13,40.47 U1.44
PA12
  Top 0.203: U$2.11 72.02,44.95 72.52,44.45 72.52,40.57 U1.45
PA13  (via drill 0.41)
  Top 0.203: U$2.12 69.48,46.37 70.13,45.72 | 70.13,45.72 71.81,44.04 71.81,40.75 | 71.81,40.75 71.81,40.56 U1.46 | 71.81,40.75 71.67,40.75 | 71.82,40.75 71.81,40.75 | 70.13,45.72 v69.6,45.2
  Bottom 0.203: R11.1 87.06,32.02 80.4,32.02 73.25,39.17 73.25,43.61 70.08,43.61 69.6,44.09 v69.6,45.2
PA14  (via drill 0.41)
  Top 0.203: U$2.13 66.94,46.29 66.85,46.2 | 66.85,46.2 63.68,43.03 63.68,42.14 U1.49 | 66.85,46.2 66.9,46.15 67.38,46.15 67.86,45.68 v68.17,45.99
  Bottom 0.203: R10.1 87.7,37.9 75.63,37.9 75.63,45.99 v68.17,45.99
PA15
  Top 0.203: U$2.14 64.4,44.56 62.76,42.93 62.76,42.34 U1.50
PB0
  Top 0.203: U$1.19 79.64,11.01 77.9,12.75 77.9,23.67 U1.26
PB1
  Top 0.203: U$1.20 82.18,9.69 78.51,13.36 78.51,23.77 U1.27
PB3
  Top 0.203: U$2.19 51.7,49.87 U1.55
PB4
  Top 0.203: U$2.20 49.16,51.71 U1.56
PB5
  Top 0.203: U$2.21 46.62,53.54 U1.57
PB6
  Top 0.203: U$2.22 44.08,55.37 U1.58
PB7
  Top 0.203: U$2.23 41.54,53.48 47.22,47.8 50.94,47.8 U1.59
PB8
  Top 0.203: U$2.24 39,54.5 56.46,37.03 60.3,37.03 U1.61
PB9
  Top 0.203: U$2.25 36.46,56.02 56.36,36.12 60.5,36.12 U1.62
PB10
  Top 0.203: U1.29 73.48,30.18 73.74,29.92 73.84,29.92 75.36,28.4 76.17,28.4 76.58,28.8 77.6,28.8 78.31,28.09 78.31,27.28 77.6,26.57 77.6,25.96 79.22,24.33 79.22,13.56 84.72,8.06 U$1.21
PB11
  Top 0.203: U$2.18 54.24,48.04 U1.54
PB12
  Top 0.203: U$1.22 87.26,8.06 86.94,8.38 85.52,8.38 79.93,13.97 79.93,32.36 76.99,35.31 75.74,35.31 U1.33
PB13
  Top 0.203: U1.34 75.95,36.22 77.39,36.22 80.95,32.66 80.95,14.17 85.62,9.5 88.57,9.5 89.8,8.27 U$1.23
PB14
  Top 0.203: U1.35 75.85,36.83 78.1,36.83 81.86,33.07 81.86,14.48 85.72,10.62 90.6,10.62 92.34,8.88 U$1.24
PB15
  Top 0.203: U1.36 75.86,37.54 78.82,37.54 82.88,33.48 82.88,15.29 86.64,11.53 92.63,11.53 94.88,9.28 U$1.25
PC0
  Top 0.203: U1.8 60.53,25.75 60.53,24.64 61.14,24.03 61.14,23.52 55.55,17.93 55.55,14.38 52.81,11.63 44.98,11.63 44.08,10.73 U$1.5
PC1
  Top 0.203: U$1.6 46.62,10.73 47.02,11.12 53.01,11.12 56.16,14.27 56.16,17.83 61.54,23.22 61.54,24.33 60.93,24.94 60.93,25.45 U1.9
PC2
  Top 0.203: U$1.7 49.16,10.32 49.56,10.72 53.21,10.72 56.57,14.07 56.57,17.63 61.95,23.01 61.95,24.64 61.54,25.04 61.54,25.35 U1.10
PC3
  Top 0.203: U$1.8 51.7,10.02 51.99,10.31 53.52,10.31 57.07,13.87 57.07,17.53 62.36,22.81 62.36,25.46 U1.11
PC4
  Top 0.203: U$1.17 74.56,18.96 75.06,19.46 75.06,25.1 U1.24
PC5
  Top 0.203: U$1.18 77.1,23.76 U1.25
PC6
  Top 0.203: U$1.26 97.42,8.06 93.04,12.45 87.35,12.45 84.2,15.6 84.2,33.48 79.32,38.35 75.96,38.35 U1.37
PC7
  Top 0.203: U$2.4 89.8,52.9 U1.38
PC8
  Top 0.203: U$2.5 87.26,51.06 U1.39
PC9
  Top 0.203: U$2.6 84.72,50.76 81.15,47.19 78.71,47.19 76.38,44.86 76.38,40.89 U1.40
PC10
  Top 0.203: U$2.15 61.86,42.54 U1.51
PC11
  Top 0.203: U$2.16 59.32,44.38 U1.52
PC12
  Top 0.203: U$2.17 56.78,46.21 U1.53
PC13
  Top 0.203: U$1.4 41.54,10.32 43.26,12.04 52.5,12.04 55.04,14.58 55.04,26.57 58.39,29.92 60.46,29.92 U1.2
PH0-OSC_IN  (via drill 0.41)
  Top 0.203: v55.31,29.01 54.04,30.28 49.92,30.28 48.49,28.85 Q1.2 | U1.5 62.46,29.8 60.65,27.99 v60.25,27.99
  Bottom 0.203: C26.1 45.15,28.05 47.69,28.05 48.33,28.69 Q1.2 | v60.25,27.99 56.33,27.99 v55.31,29.01
PH1-OSC_OUT  (via drill 0.41)
  Top 0.203: U1.6 62.86,29.51 60.02,26.67 v59.31,26.67
  Bottom 0.203: C25.1 52.46,26.31 52.46,27.74 53.41,28.69 Q1.1 53.44,27.67 54.43,26.67 v59.31,26.67
RESET  (via drill 0.41)
  Top 0.203: v55.79,24.24 58.33,24.24 63.09,29.01 U1.7 | S1.2 52.77,15.83 52.77,22.18 S1.1 52.62,22.34 50.87,24.09 47.69,24.09 46.9,23.29 | v25.79,39.64 25.15,39.64 24.68,40.12 23.88,40.12 C9.2 | IC4.19 34.99,32.98 34.2,32.98 34.04,32.82 32.61,32.82 v31.82,33.61 31.82,29.8 33.57,28.05 40.23,28.05 43.25,31.07 R3.1
  Bottom 0.203: v55.79,24.24 54.68,24.24 52.77,22.34 S1.1 | v25.79,39.64 v31.82,33.61 32.61,32.82 32.77,32.82 45.95,19.64 50.39,19.64 51.5,18.53 C10.1 51.66,18.37 51.66,15.51 52.62,15.51 S1.2
RXUSART2  (via drill 0.41)
  Top 0.203: v41.34,28.05 41.34,27.58 39.6,25.83 R13.1 | v28.17,40.44 28.17,39.01 27.85,39.01 IC4.1
  Bottom 0.203: v41.34,28.05 40.55,28.05 v28.17,40.44
SWDCLK
  Bottom 0.203: R10.2 89.76,37.74 92.78,37.74 95.95,34.56 JP1.4
SWDIO
  Bottom 0.203: R11.2 89.13,32.02 95.95,32.02 JP1.3
TXUSART2
  Top 0.203: R12.1 43.41,20.59 39.44,24.56 32.45,24.56 27.22,29.8 26.74,29.8 26.58,29.96 26.58,35.99 26.9,36.31 27.69,36.31 IC4.5
USB5V
  Top 0.203: C8.1 34.52,51.71 29.76,51.71 29.44,51.39 R1.2 29.28,51.23 26.9,48.85 23.56,48.85 18.8,44.09 | D4.A 12.13,43.14 12.93,43.93 18.64,43.93 18.8,44.09 | 18.8,44.09 21.18,44.09 C6.1
USB_D+  (via drill 0.41)
  Top 0.203: v19.75,51.71 18.48,52.98 11.02,52.98 X1.3 | v32.61,30.44 34.99,30.44 IC4.15
  Bottom 0.203: v19.75,51.71 20.55,51.71 | 20.55,51.71 23.41,51.71 D3.1 | v32.61,30.44 27.22,30.44 20.55,37.1 20.55,51.71
USB_D-  (via drill 0.41)
  Top 0.203: v25.31,49.96 21.5,53.77 11.02,53.77 X1.2 | v37.22,32.5 35.95,31.23 35.15,31.23 IC4.16
  Bottom 0.203: D3.2 23.56,49.96 v25.31,49.96 37.22,38.06 v37.22,32.5
V+
  Top 0.203: L1.1 15.47,42.34 13.56,40.44 11.66,40.44 9.75,42.34 9.75,44.25 8.48,45.52 5.94,45.52 5.94,41.07 10.39,36.63 10.39,35.99 J1.1
VBAT  (via drill 0.41)
  Top 0.203: v59.92,32.18 60.24,32.18 61.03,31.39 U1.1 | v53.57,41.71 53.57,40.75 56.74,37.58 58.49,37.58 v58.81,37.9
  Bottom 0.203: 59.92,36.79 v59.92,32.18 | 59.92,36.79 61.19,36.79 R7.2 | v53.57,41.71 55.16,41.71 55.63,42.18 C23.1 | 59.92,36.79 v58.81,37.9
VIN  (via drill 0.41)
  Top 0.203: v17.53,16.62 15.63,16.62 15.15,16.15 IC2.1 | v20.55,33.13 D1.C | v28.8,8.53 28.8,6.46 C2.+
  Bottom 0.203: 17.53,19.8 17.53,22.02 22.93,27.42 22.93,30.59 C1.+ 22.93,30.75 v20.55,33.13 | 17.53,19.8 v17.53,16.62 | 17.53,19.8 v28.8,8.53
VREF+  (via drill 0.41)
  Top 0.203: v63.73,25.67 64.05,25.67 65.32,26.94 U1.13
  Bottom 0.203: v63.73,25.67 66.11,25.67 68.01,27.58 68.01,29.01 67.7,29.32 C11.1 67.7,29.48 67.7,32.82 67.86,32.98 C13.1 68.01,33.13 68.49,33.61 68.49,36.63 R6.2
VREF+2  (via drill 0.41)
  Top 0.203: 53.89,43.77 56.11,41.55 | v53.25,44.41 53.89,43.77 | 53.89,43.77 v52.77,42.66
  Bottom 0.203: R6.1 69.92,36.63 69.92,28.85 65.95,24.88 63.41,24.88 61.35,26.94 61.35,29.64 57.85,33.13 57.85,39.17 55,39.17 52.77,41.39 v52.77,42.66 | v53.25,44.41 53.89,45.04 63.57,45.04 L4.2

### Text on the board
tNames: GND | B9 | B8 | B7 | B6 | B5 | B4 | B3 | B11
tValues: C12 | C11 | C10 | A15 | A14 | A13 | A12 | A11 | A10 | A9 | A8 | C9 | C8 | C7 | GND | 3.3V | 5V | CLK | DIO | GND | 3.3V | 5V | 3.3V | G | C13 | C0 | C1 | C2 | C3 | A0 | A1 | A2 | A3 | A4 | A5 | A6 | A7 | C4 | C5 | B0 | B1 | B10 | B12 | B13 | B14 | B15 | C6